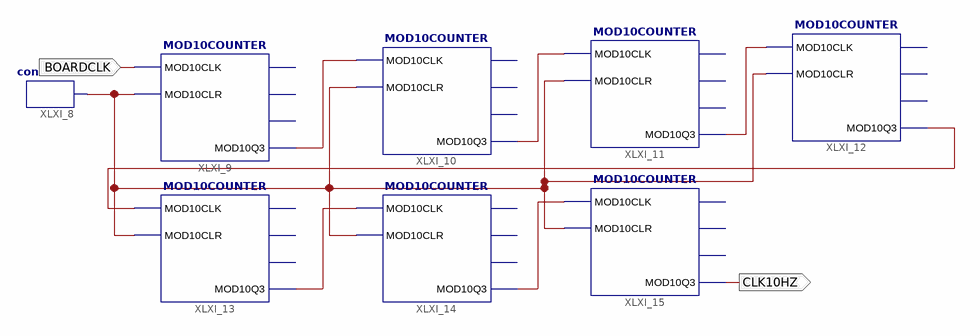
[diagram p0: schematic sheet 1]
// Xilinx ISE schematic FREQDIV107.sch (spartan6) as structural Verilog: 8 symbols, 2 ports
module FREQDIV107 (
  input  BOARDCLK,
  output CLK10HZ
);

  wire XLXN_1, XLXN_2, XLXN_3, XLXN_4, XLXN_5, XLXN_6, XLXN_7;

  constant #(.CValue("0")) XLXI_8 (.O(XLXN_7));
  MOD10COUNTER XLXI_9 (.MOD10CLK(BOARDCLK), .MOD10CLR(XLXN_7), .MOD10Q3(XLXN_1));  // open: MOD10Q0, MOD10Q1, MOD10Q2
  MOD10COUNTER XLXI_10 (.MOD10CLK(XLXN_1), .MOD10CLR(XLXN_7), .MOD10Q3(XLXN_2));  // open: MOD10Q0, MOD10Q1, MOD10Q2
  MOD10COUNTER XLXI_11 (.MOD10CLK(XLXN_2), .MOD10CLR(XLXN_7), .MOD10Q3(XLXN_6));  // open: MOD10Q0, MOD10Q1, MOD10Q2
  MOD10COUNTER XLXI_12 (.MOD10CLK(XLXN_6), .MOD10CLR(XLXN_7), .MOD10Q3(XLXN_5));  // open: MOD10Q0, MOD10Q1, MOD10Q2
  MOD10COUNTER XLXI_13 (.MOD10CLK(XLXN_5), .MOD10CLR(XLXN_7), .MOD10Q3(XLXN_3));  // open: MOD10Q0, MOD10Q1, MOD10Q2
  MOD10COUNTER XLXI_14 (.MOD10CLK(XLXN_3), .MOD10CLR(XLXN_7), .MOD10Q3(XLXN_4));  // open: MOD10Q0, MOD10Q1, MOD10Q2
  MOD10COUNTER XLXI_15 (.MOD10CLK(XLXN_4), .MOD10CLR(XLXN_7), .MOD10Q3(CLK10HZ));  // open: MOD10Q0, MOD10Q1, MOD10Q2
endmodule
